# Altium schematic sheet QFN88_FLASH_UART.SchDoc
size 635 x 457 mm
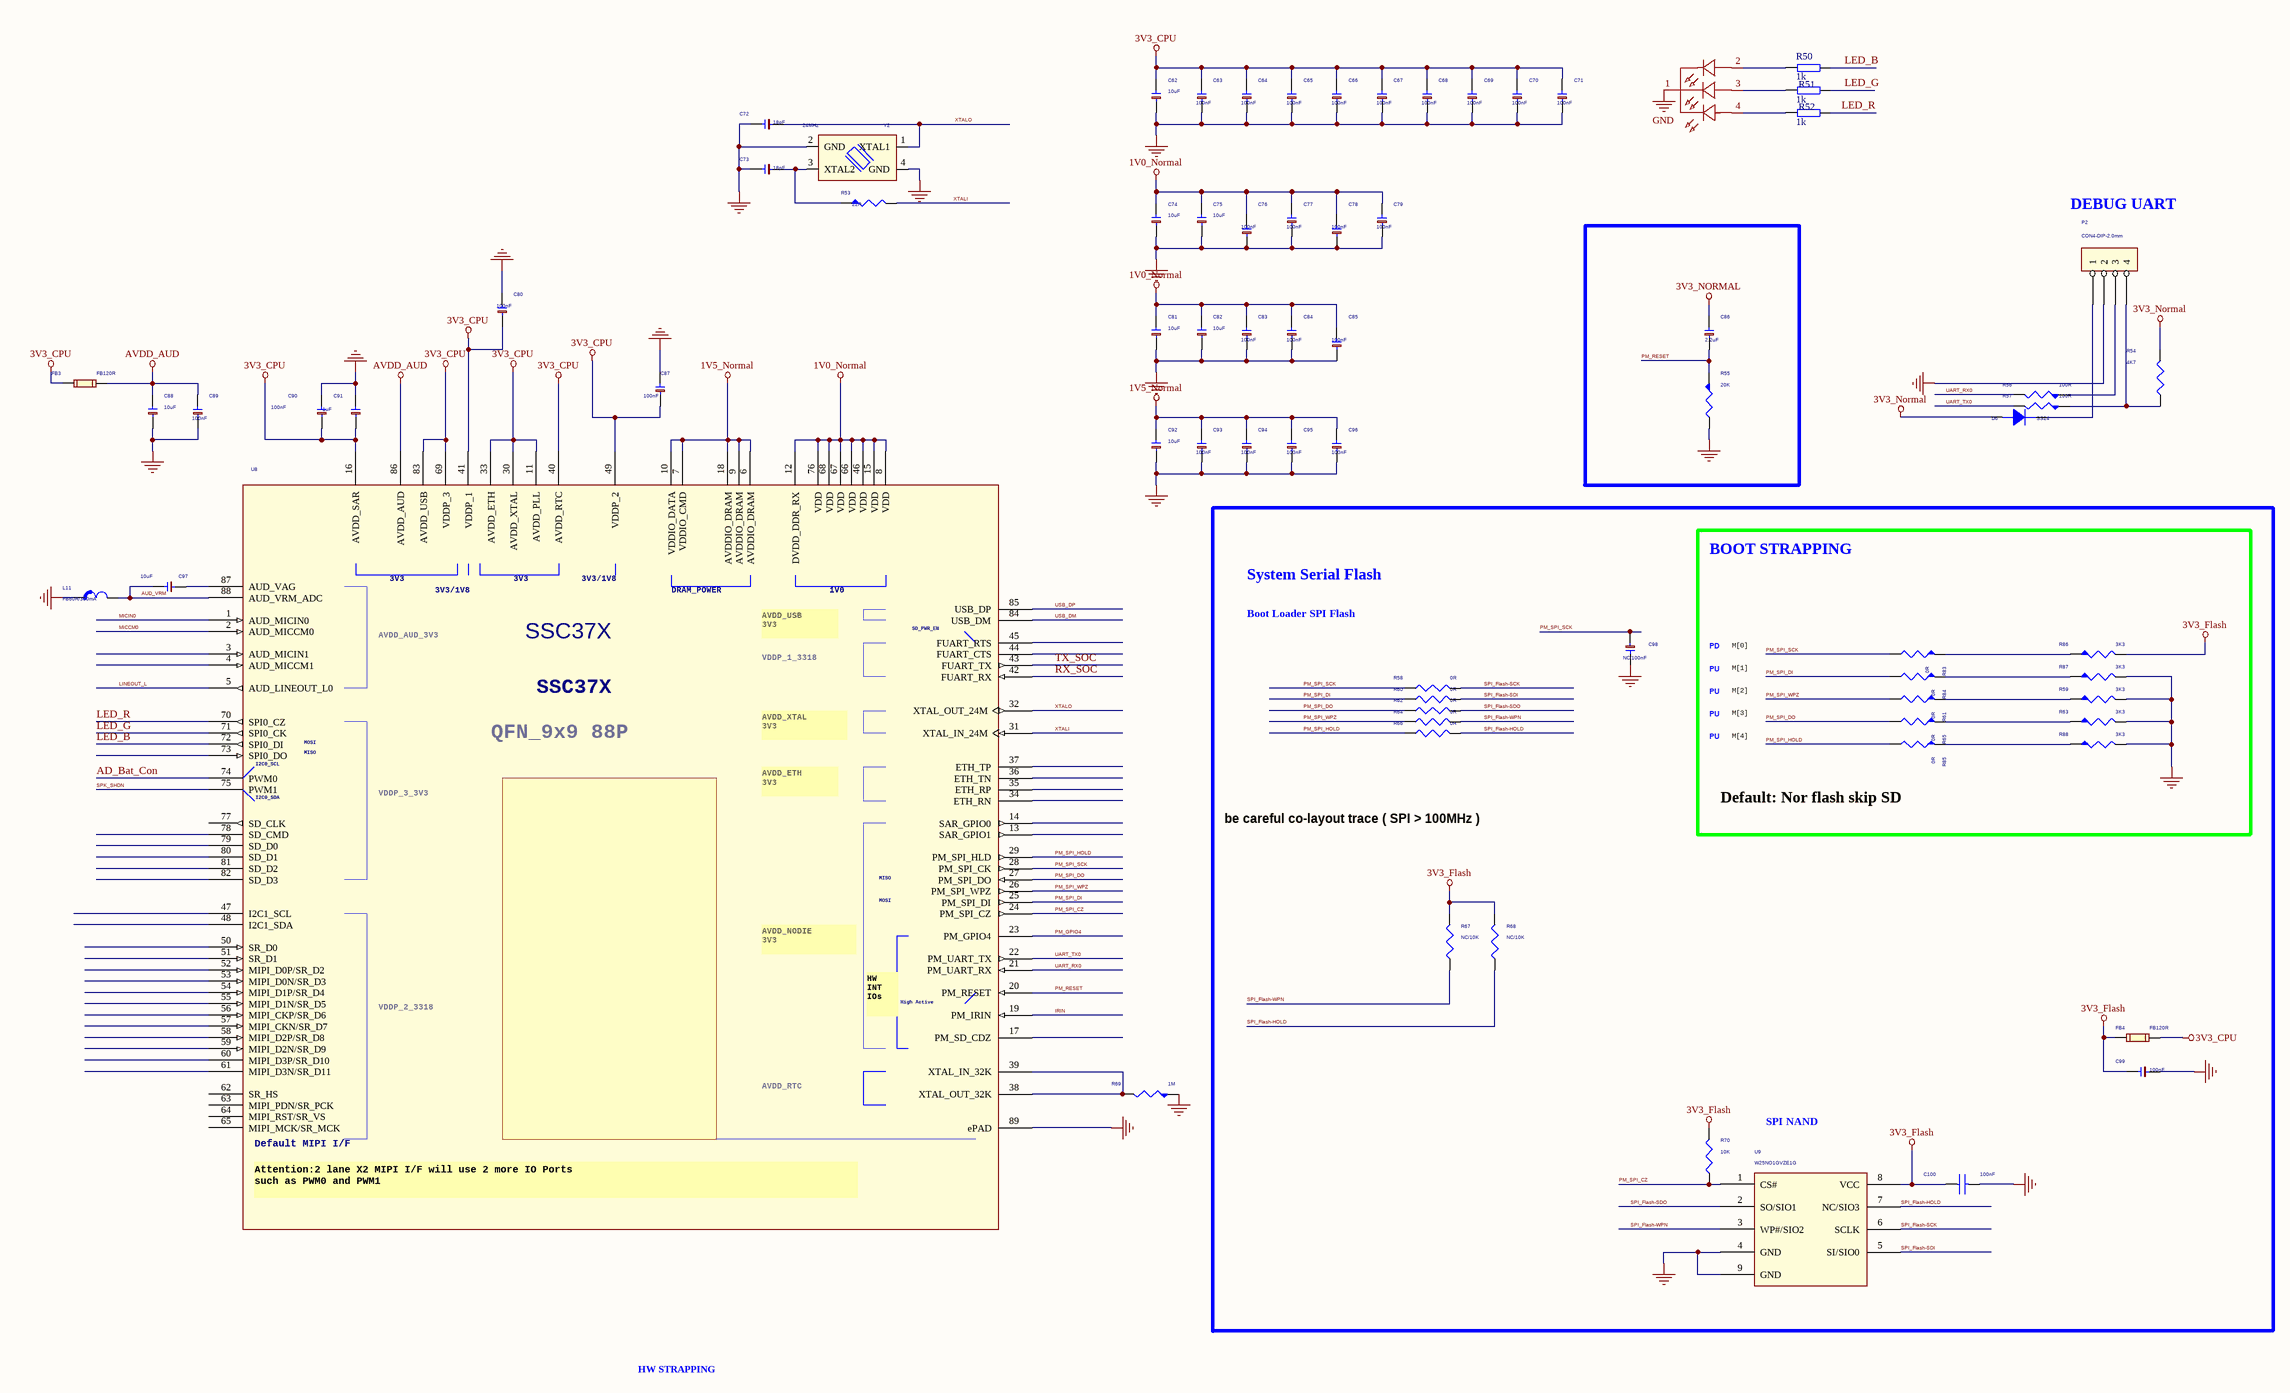
[diagram p0: QFN88_FLASH_UART.SchDoc]

## Parts
C62  10uF  [C0603]
C63  100nF  [C0402]
C64  100nF  [C0402]
C65  100nF  [C0402]
C66  100nF  [C0402]
C67  100nF  [C0402]
C68  100nF  [C0402]
C69  100nF  [C0402]
C70  100nF  [C0402]
C71  100nF  [C0402]
C72  18pF  [C0402]
C73  18pF  [C0402]
C74  10uF  [C0603]
C75  10uF  [C0603]
C76  100nF  [C0402]
C77  100nF  [C0402]
C78  100nF  [C0402]
C79  100nF  [C0402]
C80  100nF  [C0402]
C81  10uF  [C0603]
C82  10uF  [C0603]
C83  100nF  [C0402]
C84  100nF  [C0402]
C85  100nF  [C0402]
C86  2.2uF  [C0805]
C87  100nF  [C0402]
C88  10uF  [C0603]
C89  100nF  [C0402]
C90  100nF  [C0402]
C91  1uF  [C0402]
C92  10uF  [C0603]
C93  100nF  [C0402]
C94  100nF  [C0402]
C95  100nF  [C0402]
C96  100nF  [C0402]
C97  10uF  [C0402]
C98  NC/100nF  [C0402]
C99  100nF  [C0402]
C100  100nF  [C0402]
D6  SS24  [DO-214AC]
FB3  FB120R  [0603_R]
FB4  FB120R  [R0603]
L11  FB60R/300mA  [L0603]
LED2  XL-A3528RGBC-BM  [LED-ARRAY-SMD_4P-L3.2-W2.8-LS3.5-BL_XL-A3528RGBC-BM]  (value not drawn)
P2  CON4-DIP-2.0mm  [SIP4 2.0]
R50  1k  [0603_R]
R51  1k  [0603_R]
R52  1k  [0603_R]
R53  22R  [R0402]
R54  4K7  [R0402]
R55  20K  [R0402]
R56  100R  [R0402]
R57  100R  [R0402]
R58  0R  [R0402]
R59  3K3  [R0402]
R60  0R  [R0402]
R61  0R  [R0402]
R62  0R  [R0402]
R63  3K3  [R0402]
R64  0R  [R0402]
R65  0R  [R0402]
R66  0R  [R0402]
R67  NC/10K  [R0402]
R68  NC/10K  [R0402]
R69  1M  [R0402]
R70  10K  [R0402]
R83  0R  [R0402]
R84  0R  [R0402]
R85  0R  [R0402]
R86  3K3  [R0402]
R87  3K3  [R0402]
R88  3K3  [R0402]
U8  SSC37X  [IC-88P-QFN9X9-P035]
U9  W25NO1GVZE1G  [SOP8-150+208]
Y2  24MHz  [CRYSTAL-SMD_4P-L3.2-W2.5-BL]

## Nets
1V0_Normal: C74.2 C75.2 C76.1 C77.1 C78.1 C79.1 C81.2 C82.2 C83.1 C84.1 C85.1 U8.8(VDD) U8.12(DVDD_DDR_RX) U8.15(VDD) U8.46(VDD) U8.66(VDD) U8.67(VDD) U8.68(VDD) U8.76(VDD)
1V5_Normal: C92.2 C93.1 C94.1 C95.1 C96.1 U8.6(AVDDIO_DRAM) U8.7(VDDIO_CMD) U8.9(AVDDIO_DRAM) U8.10(VDDIO_DATA) U8.18(AVDDIO_DRAM)
3V3_CPU: C62.2 C63.1 C64.1 C65.1 C66.1 C67.1 C68.1 C69.1 C70.1 C71.1 C80.2 C87.2 C90.2 C91.2 FB3.1 FB4.2 U8.11(AVDD_PLL) U8.16(AVDD_SAR) U8.30(AVDD_XTAL) U8.33(AVDD_ETH) U8.40(AVDD_RTC) U8.41(VDDP_1) U8.49(VDDP_2) U8.69(VDDP_3) U8.83(AVDD_USB)
3V3_Flash: C99.1 C100.1 FB4.1 R67.1 R68.1 R70.1 R86.2 U9.8(VCC)
3V3_NORMAL: C86.1 D6.2(A) R54.1
AVDD_AUD: C88.2 C89.1 FB3.2 U8.86(AVDD_AUD)
GND: C62.1 C63.2 C64.2 C65.2 C66.2 C67.2 C68.2 C69.2 C70.2 C71.2 C72.1 C73.1 C74.1 C75.1 C76.2 C77.2 C78.2 C79.2 C80.1 C81.1 C82.1 C83.2 C84.2 C85.2 C87.1 C88.1 C89.2 C90.1 C91.1 C92.1 C93.2 C94.2 C95.2 C96.2 C98.1 C99.2 C100.2 L11.1 LED2.1 P2.2 R55.2 R59.2 R63.2 R69.1 R87.2 R88.2 U8.89(ePAD) U9.4(GND) U9.9(GND) Y2.2(GND) Y2.4(GND)
AD_Bat_Con: U8.74(PWM0)
AUD_VRM: C97.2 L11.2 U8.88(AUD_VRM_ADC)
IRIN: U8.19(PM_IRIN)
LED_B: R50.2 U8.72(SPI0_DI)
LED_G: R51.2 U8.71(SPI0_CK)
LED_R: R52.2 U8.70(SPI0_CZ)
LINEOUT_L: U8.5(AUD_LINEOUT_L0)
MICCM0: U8.2(AUD_MICCM0)
MICIN0: U8.1(AUD_MICIN0)
PM_GPIO4: U8.23(PM_GPIO4)
PM_RESET: C86.2 R55.1 U8.20(PM_RESET)
PM_SPI_CZ: R70.2 U8.24(PM_SPI_CZ) U9.1(CS#)
PM_SPI_DI: R60.1 R84.2 U8.25(PM_SPI_DI)
PM_SPI_DO: R62.1 R65.2 U8.27(PM_SPI_DO)
PM_SPI_HOLD: R66.1 R85.2 U8.29(PM_SPI_HLD)
PM_SPI_SCK: C98.2 R58.1 R83.2 U8.28(PM_SPI_CK)
PM_SPI_WPZ: R61.2 R64.1 U8.26(PM_SPI_WPZ)
RX_SOC: U8.42(FUART_RX)
SPI_Flash-HOLD: R66.2 R68.2 U9.7(NC/SIO3)
SPI_Flash-SCK: R58.2 U9.6(SCLK)
SPI_Flash-SDI: R60.2 U9.5(SI/SIO0)
SPI_Flash-SDO: R62.2 U9.2(SO/SIO1)
SPI_Flash-WPN: R64.2 R67.2 U9.3(WP#/SIO2)
SPK_SHDN: U8.75(PWM1)
TX_SOC: U8.43(FUART_TX)
UART_RX0: R56.2 U8.21(PM_UART_RX)
UART_TX0: R57.2 U8.22(PM_UART_TX)
USB_DM: U8.84(USB_DM)
USB_DP: U8.85(USB_DP)
XTALI: R53.2 U8.31(XTAL_IN_24M)
XTALO: C72.2 U8.32(XTAL_OUT_24M) Y2.1(XTAL1)
NetC73_2: C73.2 R53.1 Y2.3(XTAL2)
NetC97_1: C97.1 U8.87(AUD_VAG)
NetD6_1: D6.1(K) P2.1
NetLED2_2: LED2.2 R50.1
NetLED2_3: LED2.3 R51.1
NetLED2_4: LED2.4 R52.1
NetP2_3: P2.3 R56.1
NetP2_4: P2.4 R54.2 R57.1
NetR59_1: R59.1 R61.1
NetR63_1: R63.1 R65.1
NetR69_2: R69.2 U8.38(XTAL_OUT_32K) U8.39(XTAL_IN_32K)
NetR83_1: R83.1 R86.1
NetR84_1: R84.1 R87.1
NetR85_1: R85.1 R88.1

Not connected (* = marked no-connect by the designer): U8 3(AUD_MICIN1) 4(AUD_MICCM1) 13(SAR_GPIO1) 14(SAR_GPIO0) 17(PM_SD_CDZ) 34(ETH_RN) 35(ETH_RP) 36(ETH_TN) 37(ETH_TP) 44(FUART_CTS) 45(FUART_RTS) 47(I2C1_SCL) 48(I2C1_SDA) 50(SR_D0) 51(SR_D1) 52(MIPI_D0P/SR_D2) 53(MIPI_D0N/SR_D3) 54(MIPI_D1P/SR_D4) 55(MIPI_D1N/SR_D5) 56(MIPI_CKP/SR_D6) 57(MIPI_CKN/SR_D7) 58(MIPI_D2P/SR_D8) 59(MIPI_D2N/SR_D9) 60(MIPI_D3P/SR_D10) 61(MIPI_D3N/SR_D11) 62(SR_HS) 63(MIPI_PDN/SR_PCK) 64(MIPI_RST/SR_VS) 65(MIPI_MCK/SR_MCK) 73(SPI0_DO) 77(SD_CLK) 78(SD_CMD) 79(SD_D0) 80(SD_D1) 81(SD_D2) 82(SD_D3)

## Notes on the sheet
- DEBUG UART
- BOOT STRAPPING
- System Serial Flash
- Boot Loader SPI Flash
- PD
- PU
- M[1]
- M[0]
- M[2]
- M[3]
- M[4]
- Default: Nor flash skip SD
- be careful co-layout trace ( SPI > 100MHz )
- SPI NAND
- HW STRAPPING
- (in symbol QFN_88P_20_2) 3V3; 3V3/1V8; DRAM_POWER; 1V0; SD_PWR_EN; AVDD_USB / 3V3; AVDD_AUD_3V3; VDDP_1_3318; AVDD_XTAL / 3V3; MOSI; QFN_9x9 88P; MISO; I2C0_SCL; AVDD_ETH / 3V3; I2C0_SDA; VDDP_3_3V3; AVDD_NODIE / 3V3; High Active; VDDP_2_3318; HW / INT / IOs; Default MIPI I/F; Attention:2 lane X2 MIPI I/F will use 2 more IO Ports / such as PWM0 and PWM1

## Library data of the parts
C62 C74 C75 C81 C82 C88 C92 = C0402/100nF/10V/X7R: [ 100nF(0.1uF),10V,X7R ](0402); Part Name: 0402B104K100C; Brand: Walsin地穝; Class: Capacitor; Creator: Alan.Liu#6135/0920796617
C63-C73 C76-C80 C83-C87 C89-C91 C93-C96 C98 C99 = C0805_10uF: Class: DISCRETE
C97 = C0402: Class: DISCRETE; BOM: CAP: 4.7uF, 0603
C100 = CAP NP2
D6 = DIODE
FB3 FB4 = SMD_BEAD_FB0603: Current: 2A
L11 = L0603: Class: DISCRETE
P2 = HEADER_1x4-2mm_1
R50-R52 = RES
R53 R55-R57 R59 R61 R63 R65 R69 R83-R88 = R-PIN-Mark
R54 R67 R68 R70 = R_Dup2
R58 R60 R62 R64 R66 = R_Dup1
U8 = QFN_88P_20_2
U9 = 24C08_3
Y2 = OSC-20MHz_HALF_4: Class: IC; BOM: DIP-OSC 20MHz  HALF <TXC>
LED2 = XL-A3528RGBC-BM: Symbol: XL-A3528RGBC-BM